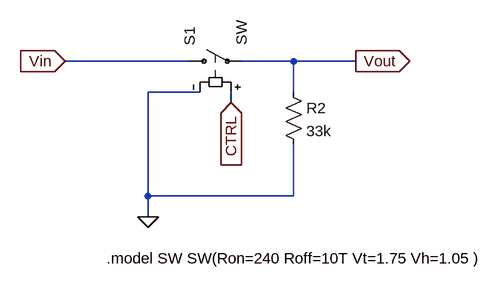
[diagram p0: schematic analog-switch.asc]
analog-switch.asc, the LTspice schematic file:
Version 4
SHEET 1 880 680
WIRE 0 128 -192 128
WIRE 160 128 80 128
WIRE 256 128 160 128
WIRE 16 176 -64 176
WIRE 160 176 160 128
WIRE 64 192 64 176
WIRE -64 336 -64 176
WIRE 160 336 160 256
WIRE 160 336 -64 336
WIRE -64 368 -64 336
FLAG -64 368 0
FLAG 256 128 Vout
IOPIN 256 128 Out
FLAG -192 128 Vin
IOPIN -192 128 In
FLAG 64 192 CTRL
IOPIN 64 192 In
SYMBOL sw -16 128 R270
SYMATTR InstName S1
SYMBOL res 144 160 R0
SYMATTR InstName R2
SYMATTR Value 33k
TEXT -128 432 Left 2 !.model SW SW(Ron=240 Roff=10T Vt=1.75 Vh=1.05 )

The netlist it stands for:
* analog-switch.asc
S1 Vin Vout CTRL 0 SW
R2 Vout 0 33k
.model SW SW(Ron=240 Roff=10T Vt=1.75 Vh=1.05 )
.backanno
.end